# EAGLE design teensyflash (EAGLE 7.2.0)
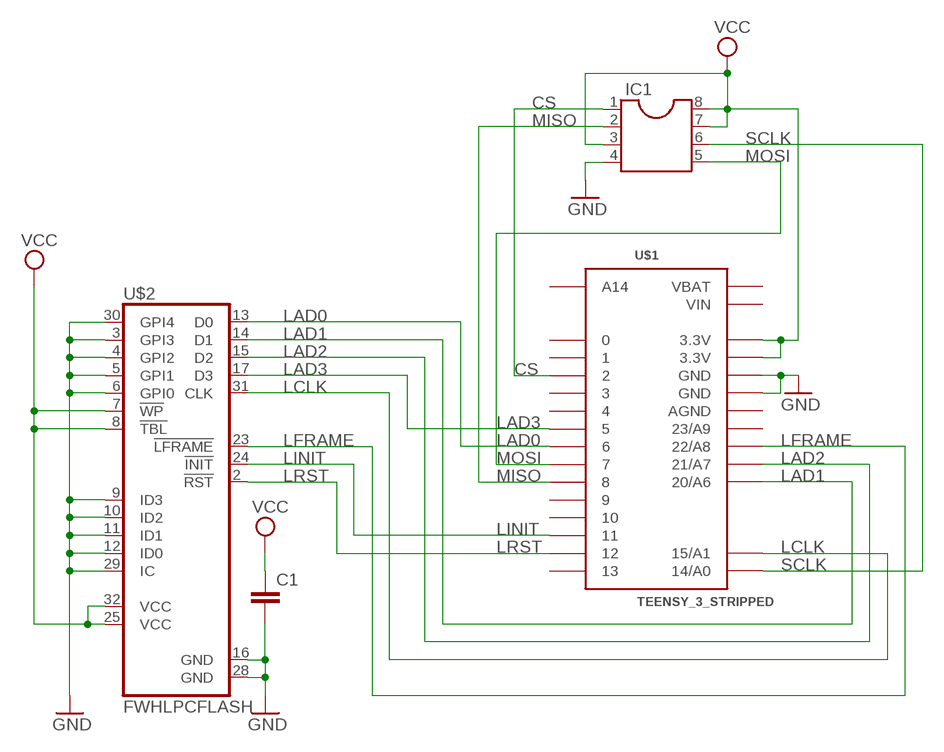
[diagram p0: schematic, sheet 1]

## Parts
C1  C-EUC0805  [C0805]
IC1  DIL8  [DIL08]
U$1  TEENSY_3_STRIPPED  [TEENSY_3_STRIPPED]
U$2  FWHLPCFLASH  [PLCC32]

## Nets
CS: IC1.1 U$1.2
GND: C1.2 IC1.4 U$1.GND U$1.GND1(GND) U$2.3(GPI3) U$2.4(GPI2) U$2.5(GPI1) U$2.6(GPI0) U$2.9(ID3) U$2.10(ID2) U$2.11(ID1) U$2.12(ID0) U$2.16(GND) U$2.28(GND) U$2.29(IC) U$2.30(GPI4)
LAD0: U$1.6 U$2.13(D0)
LAD1: U$1.20/A6 U$2.14(D1)
LAD2: U$1.21/A7 U$2.15(D2)
LAD3: U$1.5 U$2.17(D3)
LCLK: U$1.15/A1 U$2.31(CLK)
LFRAME: U$1.22/A8 U$2.23(!LFRAME)
LINIT: U$1.11 U$2.24(!INIT)
LRST: U$1.12 U$2.2(!RST)
MISO: IC1.2 U$1.8
MOSI: IC1.5 U$1.7
SCLK: IC1.6 U$1.14/A0
VCC: C1.1 IC1.3 IC1.7 IC1.8 U$1.3.3V U$1.3.3V1(3.3V) U$2.7(!WP) U$2.8(!TBL) U$2.25(VCC) U$2.32(VCC)
Unconnected: U$1.0 U$1.1 U$1.3 U$1.4 U$1.9 U$1.10 U$1.13 U$1.23/A9 U$1.RESET(A14)

## Power pins joined to a net without a drawn wire
AGND: U$1.AGND
VBAT: U$1.VBAT
VIN: U$1.VIN

## Library data of the parts
C1 = rcl:C-EU: CAPACITOR, European symbol
IC1 = ic-package:DIL8: Dual In Line / Socket
U$1 = Teensy3.0:TEENSY_3_STRIPPED
U$2 = lpcfwhflash:FWHLPCFLASH

## Net classes
0 default: width 0.203 mm, clearance 0.203 mm

## Board
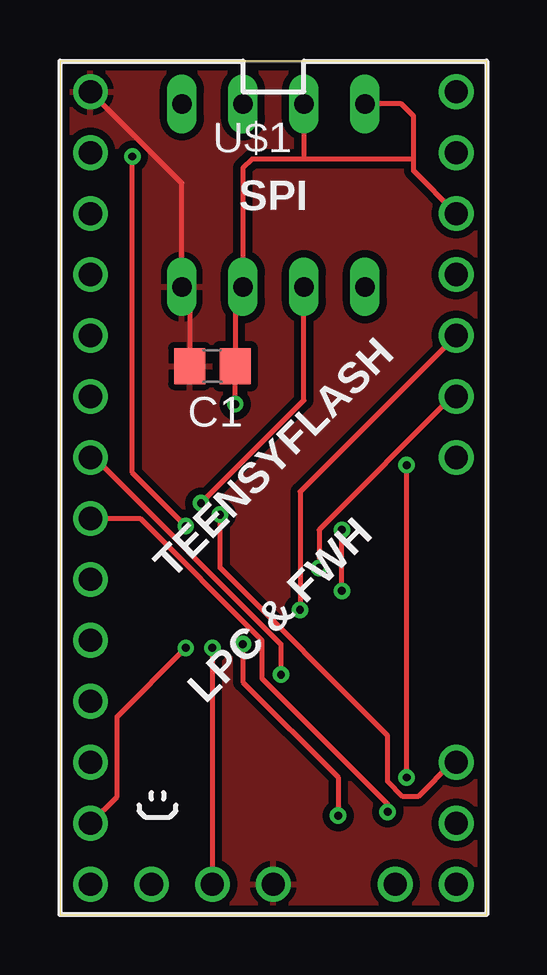
[diagram p1: board, top side]
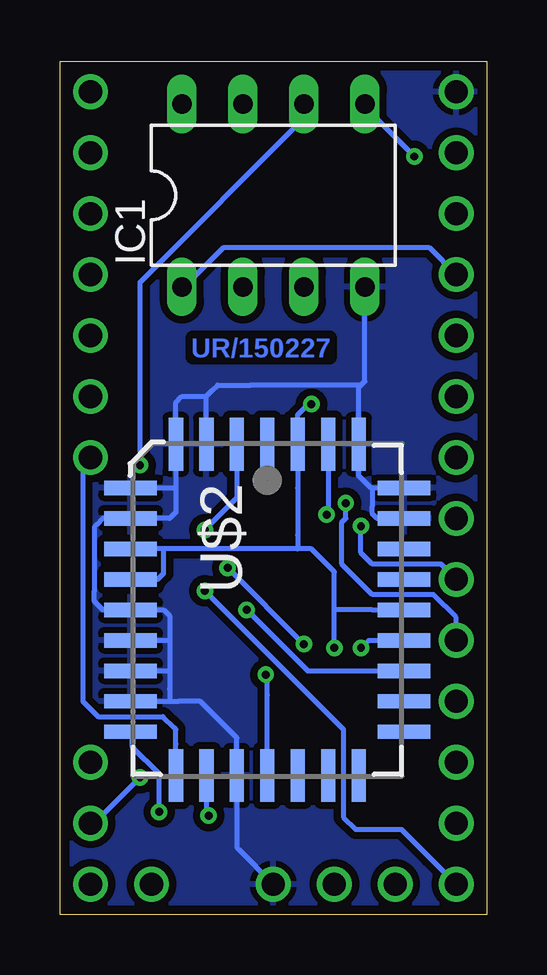
[diagram p2: board, bottom side, seen from below]

Size 17.78 x 35.56 mm. Coordinates in mm from the lower left corner, seen from the top.
Outline: 0,0 17.78,0 17.78,35.56 0,35.56 0,0
Copper layers (1*16): Top 0.0356mm / dielectric 1.5011mm / Bottom 0.0356mm
Design rules "oshpark *": minimum track width 6mil, minimum drill 13mil, track to track 6mil, track to pad 6mil, pad to pad 6mil, via to via 6mil, smd to smd 6mil, copper to edge 15mil, drill to drill 6mil, minimum pad ring 7mil, minimum via ring 7mil, stop-mask expansion 3mil, vias tented up to drill 14mil, thermal gap 10mil

### Footprints (pad centres in the part's own frame; a part is rotated, then mirrored left to right if it is on the bottom)
C0805 = smd 1.3 x 1.5: 1 -0.95,0; 2 0.95,0
DIL08 = drill 0.813 long: 1 -3.81,-3.81; 2 -1.27,-3.81; 3 1.27,-3.81; 4 3.81,-3.81; 5 3.81,3.81; 6 1.27,3.81; 7 -1.27,3.81; 8 -3.81,3.81
TEENSY_3_STRIPPED = drill 0.965: 0 -7.62,13.97; 1 -7.62,11.43; 2 -7.62,8.89; 3 -7.62,6.35; 3.3V 7.62,11.43; 3.3V1 -2.54,-16.51; 4 -7.62,3.81; 5 -7.62,1.27; 6 -7.62,-1.27; 7 -7.62,-3.81; 8 -7.62,-6.35; 9 -7.62,-8.89; 10 -7.62,-11.43; 11 -7.62,-13.97; 12 -7.62,-16.51; 13 7.62,-16.51; 14/A0 7.62,-13.97; 15/A1 7.62,-11.43; 20/A6 7.62,1.27; 21/A7 7.62,3.81; 22/A8 7.62,6.35; 23/A9 7.62,8.89; AGND 7.62,13.97; GND -7.62,16.51; GND1 0,-16.51; RESET 5.08,-16.51; VBAT -5.08,-16.51; VIN 7.62,16.51
PLCC32 = smd 0.6 x 2.2: 1 0,6.9; 2 -1.27,6.9; 3 -2.54,6.9; 4 -3.81,6.9; 14 -3.81,-6.9; 15 -2.54,-6.9; 16 -1.27,-6.9; 17 0,-6.9; 18 1.27,-6.9; 19 2.54,-6.9; 20 3.81,-6.9; 30 3.81,6.9; 31 2.54,6.9; 32 1.27,6.9 | smd 2.2 x 0.6: 5 -5.7,5.08; 6 -5.7,3.81; 7 -5.7,2.54; 8 -5.7,1.27; 9 -5.7,0; 10 -5.7,-1.27; 11 -5.7,-2.54; 12 -5.7,-3.81; 13 -5.7,-5.08; 21 5.7,-5.08; 22 5.7,-3.81; 23 5.7,-2.54; 24 5.7,-1.27; 25 5.7,0; 26 5.7,1.27; 27 5.7,2.54; 28 5.7,3.81; 29 5.7,5.08

### Placement (x,y rotation side)
C1  6.35,22.86 180 top
IC1  8.89,29.97 0 bottom
U$1  8.89,17.78 0 top
U$2  9.14,12.7 0 bottom

### Tracks (layer width: path | path; a pad name or v marks a point on that pad's centre or on a via)
CS
  Bottom 0.203: U$1.2 2.38,27.78 10.99,27.78 12.57,26.19 12.7,26.19 IC1.1
GND
  Top 0.203: C1.2 5.4,25.72 5.08,26.04 IC1.4 5.08,26.19 5.08,30.48 U$1.GND
  Bottom 0.203: U$2.10 14.92,11.43 13.21,11.43 | U$1.GND1 10.32,2.7 10.41,2.79 U$2.16 10.41,7.37 11.94,8.89 12.86,8.89 13.21,8.89 | 4.76,17.78 4.76,17.02 4.76,16.7 4.57,16.51 U$2.28 | 4.76,17.78 U$2.29 4.76,17.78 | 5.24,22.07 5.08,22.23 IC1.4 | 5.24,22.07 9.84,22.07 11.21,22.07 11.43,21.84 11.68,21.59 | 4.76,17.78 4.83,17.78 5.33,18.29 U$2.30 5.33,21.97 5.24,22.07 | U$2.3 11.68,21.59 | 11.68,21.59 12.7,21.59 12.95,21.34 U$2.4 12.95,17.78 | 12.95,17.78 12.95,16.76 13.21,16.51 U$2.6 16,16.51 16.26,16.26 16.35,16.16 16.35,15.72 16.35,13.49 16.35,13.05 16,12.7 14.92,12.7 U$2.9 13.46,12.7 13.21,12.45 13.21,11.43 | U$2.5 12.95,17.78 | 13.21,11.43 13.21,10.16 | 13.21,10.16 13.21,9.4 13.21,8.89 | U$2.11 13.72,10.16 13.21,10.16 | U$2.12 13.21,8.89
  pour Bottom (isolate 0.305): 0,0 17.78,0 17.78,35.56 0,35.56
  pour Top (isolate 0.305): 0,0 17.78,0 17.78,35.56 0,35.56
LAD0  (via drill 0.33)
  Top 0.203: v13.65,4.29 13.65,4.6 8.41,9.84 8.41,11.43 3.33,16.51 U$1.6
  Bottom 0.203: v13.65,4.29 13.65,5.87 14.76,6.99 14.76,7.62 U$2.13
LAD1
  Bottom 0.203: U$1.20/A6 16.83,18.73 16.83,8.89 16.19,8.26 13.49,8.26 13.02,7.78 12.95,7.71 12.95,7.11 U$2.14
LAD2  (via drill 0.33)
  Top 0.203: v11.59,4.13 11.59,5.71 7.62,9.68 v7.62,11.27 | v10.79,14.45 10.79,16.03 16.35,21.59 U$1.21/A7
  Bottom 0.203: v10.79,14.45 v7.62,11.27 | U$2.15 11.68,4.22 v11.59,4.13
LAD3  (via drill 0.33)
  Top 0.203: v9.21,10 9.21,11.27 1.43,19.05 U$1.5
  Bottom 0.203: v9.21,10 arc90 9.14,9.94 9.14,9.14 9.14,5.94 9.21,5.87 9.21,5.86 arc-90 U$2.17
LCLK  (via drill 0.33)
  Top 0.203: v6.67,16.67 6.67,14.45 13.65,7.46 13.65,5.56 14.29,4.92 14.92,4.92 16.35,6.35 U$1.15/A1
  Bottom 0.203: U$2.31 6.6,16.73 v6.67,16.67
LFRAME  (via drill 0.33)
  Top 0.203: v10,12.7 10,17.62 U$1.22/A8
  Bottom 0.203: v10,12.7 7.46,10.16 3.49,10.16 U$2.23
LINIT  (via drill 0.33)
  Top 0.203: v5.24,11.11 2.38,8.26 2.38,4.92 U$1.11
  Bottom 0.203: v5.24,11.11 4.92,11.43 3.49,11.43 U$2.24
LRST  (via drill 0.33)
  Top 0.203: v11.75,13.49 v11.75,16.03
  Bottom 0.203: v11.75,16.03 10.48,17.3 10.41,17.37 10.41,17.78 U$2.2 | v11.75,13.49 6.51,8.26 5.97,7.71 5.97,4.06 5.46,3.56 3.56,3.56 2.38,2.38 U$1.12
MISO  (via drill 0.33)
  Top 0.203: v5.87,17.14 10.16,21.43 10.16,26.04 IC1.2
  Bottom 0.203: v5.87,17.14 5.87,16.51 6.03,16.35 6.03,14.61 4.76,13.34 2.22,13.34 1.27,12.38 U$1.8
MOSI  (via drill 0.33)
  Top 0.203: v3.02,31.59 3.02,18.41 v5.24,16.19
  Bottom 0.203: v3.02,31.59 5.08,33.66 IC1.5 | v5.24,16.19 5.24,15.08 4.76,14.61 1.91,14.61 U$1.7
SCLK  (via drill 0.33)
  Top 0.203: v14.45,5.71 v14.45,18.73
  Bottom 0.203: v14.45,18.73 14.45,26.35 7.62,33.18 7.62,33.66 IC1.6 | v14.45,5.71 16.35,3.81 U$1.14/A0
VCC  (via drill 0.33)
  Top 0.203: C1.1 7.3,25.72 7.62,26.04 IC1.3 7.62,26.19 7.62,31.11 8,31.5 10.16,31.5 | C1.1 | v6.35,11.11 U$1.3.3V1 | v7.3,21.27 C1.1 | U$1.3.3V 14.73,30.99 14.73,31.5 | 14.73,31.5 14.73,33.27 14.22,33.78 IC1.8 | 10.16,31.5 14.73,31.5 | IC1.7 10.16,31.5
  Bottom 0.203: 14.92,15.24 U$2.7 14.76,15.24 13.46,15.24 | U$2.25 3.49,12.7 4.76,12.7 6.35,12.7 | 7.87,15.24 7.3,15.24 6.35,14.29 6.35,12.7 | 7.87,15.24 13.46,15.24 | v7.3,21.27 7.43,21.27 7.62,21.08 7.87,20.83 U$2.32 7.87,17.78 7.87,15.81 7.87,15.24 | v6.35,11.11 6.35,12.7 | 14.92,13.97 U$2.8 | U$2.8 14.73,13.97 | 14.73,13.97 13.72,13.97 13.46,14.22 13.46,15.24 | U$2.8 14.73,13.97

### Text on the board
Bottom: UR/150227
tPlace: SPI | TEENSYFLASH | LPC & FWH